# EAGLE schematic Tuxador_r1 (EAGLE 6.5.0)
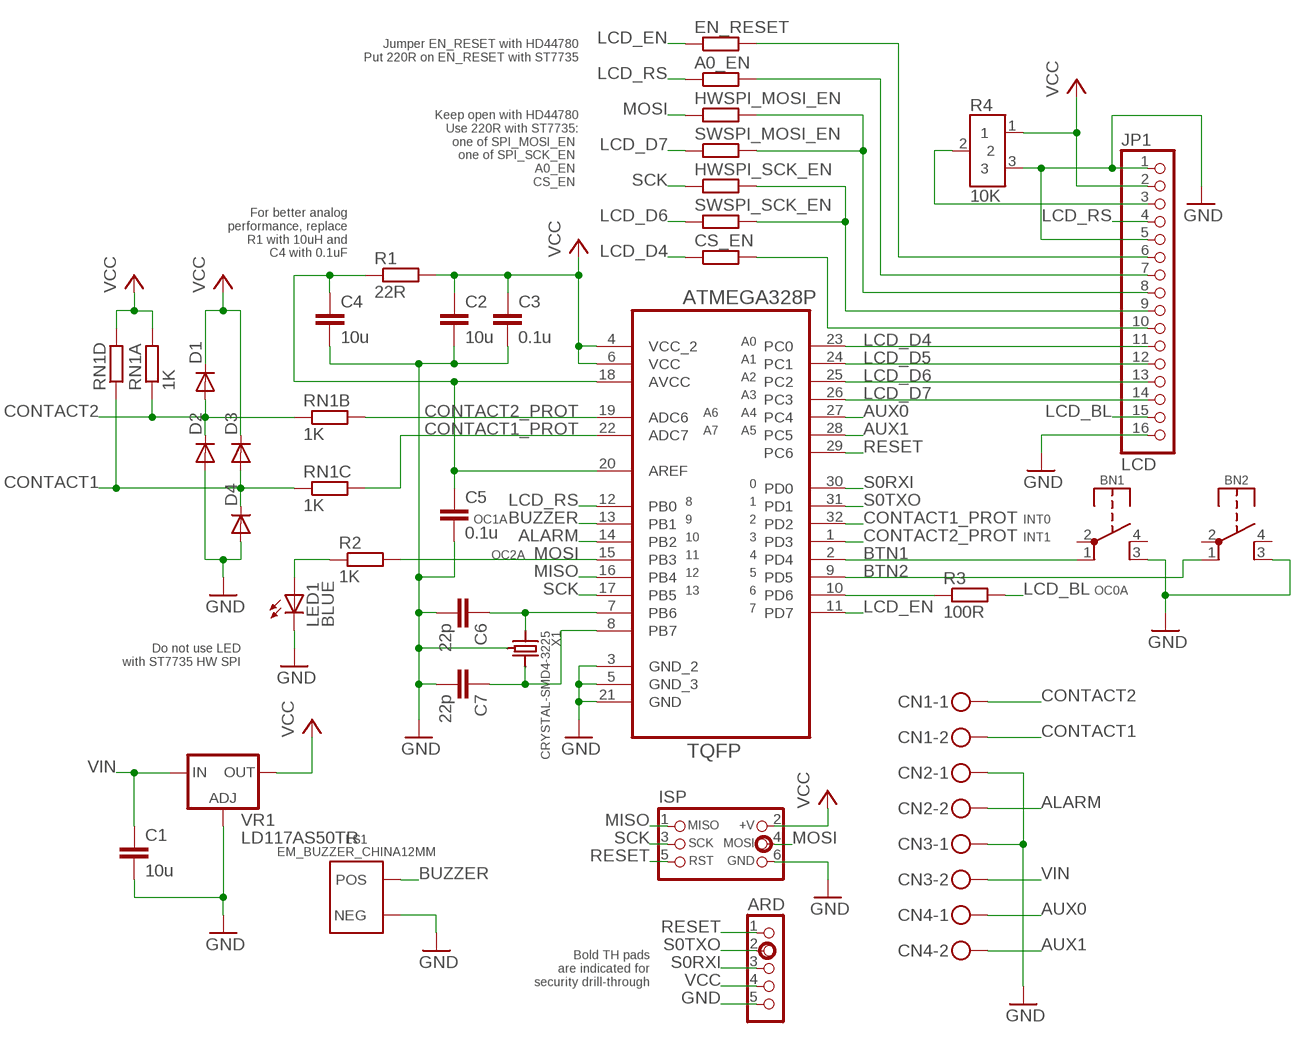
[diagram p0: schematic, sheet 1]

## Parts
A0_EN  -0-  R-EU_R1206  [R1206]
ARD  CON_HEADER_1X05-PTH  [M1X5]
BN1  SCHURTER_PUSHBTN_LPH  [SCHURTER_LPH]
BN2  SCHURTER_PUSHBTN_LPH  [SCHURTER_LPH]
C1  10u  C-EUC0805  [C0805]
C2  10u  C-EUC0805  [C0805]
C3  0.1u  C-EUC0805  [C0805]
C4  10u  C-EUC0805  [C0805]
C5  0.1u  C-EUC0805  [C0805]
C6  22p  C-EUC0603  [C0603]
C7  22p  C-EUC0603  [C0603]
CN1  MKDSN1,5/2-5,08  [MKDSN1,5/2-5,08]
CN2  MKDSN1,5/2-5,08  [MKDSN1,5/2-5,08]
CN3  MKDSN1,5/2-5,08  [MKDSN1,5/2-5,08]
CN4  MKDSN1,5/2-5,08  [MKDSN1,5/2-5,08]
CS_EN  -0-  R-EU_R1206  [R1206]
D1  DIODE-SOT23  [SOT-23]
D2  DIODE-SOT23  [SOT-23]
D3  DIODE-SOT23  [SOT-23]
D4  DIODE-SOT23  [SOT-23]
EN_RESET  -0-  R-EU_R1206  [R1206]
HWSPI_MOSI_EN  -0-  R-EU_R1206  [R1206]
HWSPI_SCK_EN  -0-  R-EU_R1206  [R1206]
ISP  CON_HEADER_PRG_AVR_ICSP_NOLBL  [HEADER_PRG_2X03_NOLBL]
JP1  LCD  PINHD-1X16  [1X16]
LED1  BLUE  LED-3MM  [LED-3MM]
LS1  EM_BUZZER_CHINA12MM  [CHINA_ELECTRO_SOUNDER_12MM]
R1  22R  R-EU_R1206  [R1206]
R2  1K  R-EU_R1206  [R1206]
R3  100R  R-EU_R1206  [R1206]
R4  10K  BI-TECH_36P-POT  [BI-TECH_36P-POT]
RN1  1K  RESISTOR_ARRAY_4  [RN8P-4R-CRA06S]
SWSPI_MOSI_EN  -0-  R-EU_R1206  [R1206]
SWSPI_SCK_EN  -0-  R-EU_R1206  [R1206]
U1  ATMEGA328P-AU  [QFP80P900X900X120-32N]
VR1  LD117AS50TR  [SOT223]
X1  CRYSTAL-SMD4-3225  [3.2X2.5MM]

## Nets
ALARM: CN2.2 U1.14(PB2)
AUX0: CN4.1 U1.27(PC4)
AUX1: CN4.2 U1.28(PC5)
AVCC: C4.1 C5.1 R1.1 U1.18(AVCC) U1.20(AREF)
BTN1: BN1.1 U1.2(PD4)
BTN2: BN2.1 U1.9(PD5)
BUZZER: LS1.POS U1.13(PB1)
CONTACT1: CN1.2 D3.1(A) D4.3(C) RN1.3 RN1.4
CONTACT1_PROT: RN1.6 U1.22(ADC7) U1.32(PD2)
CONTACT2: CN1.1 D1.1(A) D2.3(C) RN1.1 RN1.2
CONTACT2_PROT: RN1.7 U1.1(PD3) U1.19(ADC6)
GND: ARD.5 BN1.3 BN2.3 C1.2 C2.2 C3.2 C4.2 C5.2 C6.2 C7.2 CN2.1 CN3.1 D2.1(A) D4.1(A) ISP.6(GND) JP1.1 JP1.5 JP1.16 LED1.K(C) LS1.NEG R4.3 U1.3(GND_2) U1.5(GND_3) U1.21(GND) VR1.1(ADJ) X1.2(GND) X1.4(GND)
LCD_BL: JP1.15 R3.2
LCD_BL_MCU: R3.1 U1.10(PD6)
LCD_D4: CS_EN.1 JP1.11 U1.23(PC0)
LCD_D5: JP1.12 U1.24(PC1)
LCD_D6: JP1.13 SWSPI_SCK_EN.1 U1.25(PC2)
LCD_D7: JP1.14 SWSPI_MOSI_EN.1 U1.26(PC3)
LCD_EN: EN_RESET.1 U1.11(PD7)
LCD_EN_RESET: EN_RESET.2 JP1.6
LCD_RS: A0_EN.1 JP1.4 U1.12(PB0)
MISO: ISP.1(MISO) U1.16(PB4)
MOSI: HWSPI_MOSI_EN.1 ISP.4(MOSI) R2.2 U1.15(PB3)
N$1: LED1.A R2.1
N$3: JP1.3 R4.2
N$4: A0_EN.2 JP1.7
N$5: HWSPI_MOSI_EN.2 JP1.8 SWSPI_MOSI_EN.2
N$6: HWSPI_SCK_EN.2 JP1.9 SWSPI_SCK_EN.2
N$7: CS_EN.2 JP1.10
OSC1: C6.1 U1.7(PB6) X1.1
OSC2: C7.1 U1.8(PB7) X1.3
RESET: ARD.1 ISP.5(RST) U1.29(PC6)
S0RXI: ARD.3 U1.30(PD0)
S0TXO: ARD.2 U1.31(PD1)
SCK: HWSPI_SCK_EN.1 ISP.3(SCK) U1.17(PB5)
VCC: ARD.4 C2.1 C3.1 D1.3(C) D3.3(C) ISP.2(+V) JP1.2 R1.2 R4.1 RN1.5 RN1.8 U1.4(VCC_2) U1.6(VCC) VR1.4(OUT)
VIN: C1.1 CN3.2 VR1.3(IN)
Unconnected: BN1.2 BN1.4 BN2.2 BN2.4

## Notes on the sheet
- Jumper EN_RESET with HD44780
  Put 220R on EN_RESET with ST7735
- Keep open with HD44780
  Use 220R with ST7735:
  one of SPI_MOSI_EN 
  one of SPI_SCK_EN 
  A0_EN 
  CS_EN
- For better analog
  performance, replace
  R1 with 10uH and
  C4 with 0.1uF
- A0
- A1
- A2
- A3
- A6 | A4
- A7 | A5
- 0
- 8 | 1
- OC1A | 9 | 2 | INT0
- 10 | 3 | INT1
- OC2A | 11 | 4
- 12 | 5
- 13 | 6 | OC0A
- 7
- Do not use LED
  with ST7735 HW SPI
- Bold TH pads
  are indicated for
  security drill-through

## Library data of the parts
A0_EN CS_EN EN_RESET HWSPI_MOSI_EN HWSPI_SCK_EN R1-R3 SWSPI_MOSI_EN SWSPI_SCK_EN = rcl:R-EU_: RESISTOR, European symbol
ARD = dp_devices:CON_HEADER_1X05
BN1 BN2 = _trueControl:SCHURTER_PUSHBTN_LPH
C1-C7 = rcl:C-EU: CAPACITOR, European symbol
CN1-CN4 = con-phoenix-508:MKDSN1,5/2-5,08: MKDSN 1,5/ 2-5,08 Printklemme Nennstrom: 13,5 A Nennspannung: 250 V Rastermaß: 5,08 mm Polzahl: 2 Anschlussart: Schraubanschluss Montage: Löten Anschlussrichtung Leiter/Platine: 0 ° Artikelnummer: 1729128 Source: http://eshop.phoenixcontact.com .. 1729128.pdf; MPN: MKDSN 1,5/2-5.08; OC_FARNELL: 1792903; OC_NEWARK: 30M2397
D1-D4 = dp_devices:DIODE: Various Diode Packages
ISP = dp_devices:CON_HEADER_PRG_AVR_ICSP: 2x3 AVR ICSP programming header
JP1 = pinhead:PINHD-1X16: PIN HEADER
LED1 = dp_devices:LED: Light Emitting Diode
LS1 = _3k:EM_BUZZER
R4 = _trueControl:BI-TECH_36P-POT
RN1 = dp_devices:RESISTOR_ARRAY_4: 4 Resistor Array 0603
U1 = Ava:ATMEGA328P-AU; DESCRIPTION: 8-bit Microcontroller with In-System Programmable Flash; MPN: ATMEGA328P-AU; OC_FARNELL: 1715486; OC_NEWARK: 14R4631; PACKAGE: TQFP-32; SUPPLIER: Atmel
VR1 = v-reg:LD117A?*: Low drop fixed and adjustable positive voltage regulators 1 A Source: http://www.st.com/stonline/products/literature/ds/7194/ld1117axx.pdf
X1 = abracon:CRYSTAL-SMD4